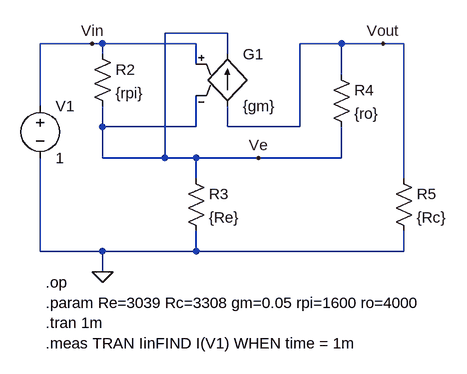
[diagram p0: schematic CE-degen-rin.asc]
CE-degen-rin.asc, the LTspice schematic file:
Version 4
SHEET 1 1048 680
WIRE 432 128 336 128
WIRE 224 144 144 144
WIRE 240 144 224 144
WIRE 384 144 240 144
WIRE 608 144 544 144
WIRE 672 144 608 144
WIRE 704 144 672 144
WIRE 240 160 240 144
WIRE 432 160 432 128
WIRE 384 176 384 144
WIRE 608 192 608 144
WIRE 144 240 144 144
WIRE 240 272 240 240
WIRE 384 272 384 224
WIRE 384 272 240 272
WIRE 432 272 432 240
WIRE 544 272 544 144
WIRE 544 272 432 272
WIRE 240 320 240 272
WIRE 336 320 336 128
WIRE 336 320 240 320
WIRE 384 320 336 320
WIRE 480 320 384 320
WIRE 608 320 608 272
WIRE 608 320 480 320
WIRE 384 352 384 320
WIRE 704 352 704 144
WIRE 144 464 144 320
WIRE 240 464 144 464
WIRE 384 464 384 432
WIRE 384 464 240 464
WIRE 704 464 704 432
WIRE 704 464 384 464
WIRE 240 496 240 464
FLAG 240 496 0
FLAG 672 144 Vout
FLAG 480 320 Ve
FLAG 224 144 Vin
SYMBOL res 224 144 R0
SYMATTR InstName R2
SYMATTR Value {rpi}
SYMBOL res 368 336 R0
SYMATTR InstName R3
SYMATTR Value {Re}
SYMBOL res 592 176 R0
SYMATTR InstName R4
SYMATTR Value {ro}
SYMBOL res 688 336 R0
SYMATTR InstName R5
SYMATTR Value {Rc}
SYMBOL g 432 144 R0
SYMATTR InstName G1
SYMATTR Value {gm}
SYMBOL voltage 144 224 R0
SYMATTR InstName V1
SYMATTR Value 1
TEXT 152 512 Left 2 !.op\n.param Re=3039 Rc=3308 gm=0.05 rpi=1600 ro=4000\n.tran 1m\n.meas TRAN IinFIND I(V1) WHEN time = 1m

The netlist it stands for:
* CE-degen-rin.asc
R2 Vin Ve {rpi}
R3 Ve 0 {Re}
R4 Vout Ve {ro}
R5 Vout 0 {Rc}
G1 Vout Ve Vin Ve {gm}
V1 Vin 0 1
.op
.param Re=3039 Rc=3308 gm=0.05 rpi=1600 ro=4000
.tran 1m
.meas TRAN IinFIND I(V1) WHEN time = 1m
.backanno
.end